# Altium schematic sheet FPGA Banks.SchDoc
size A4
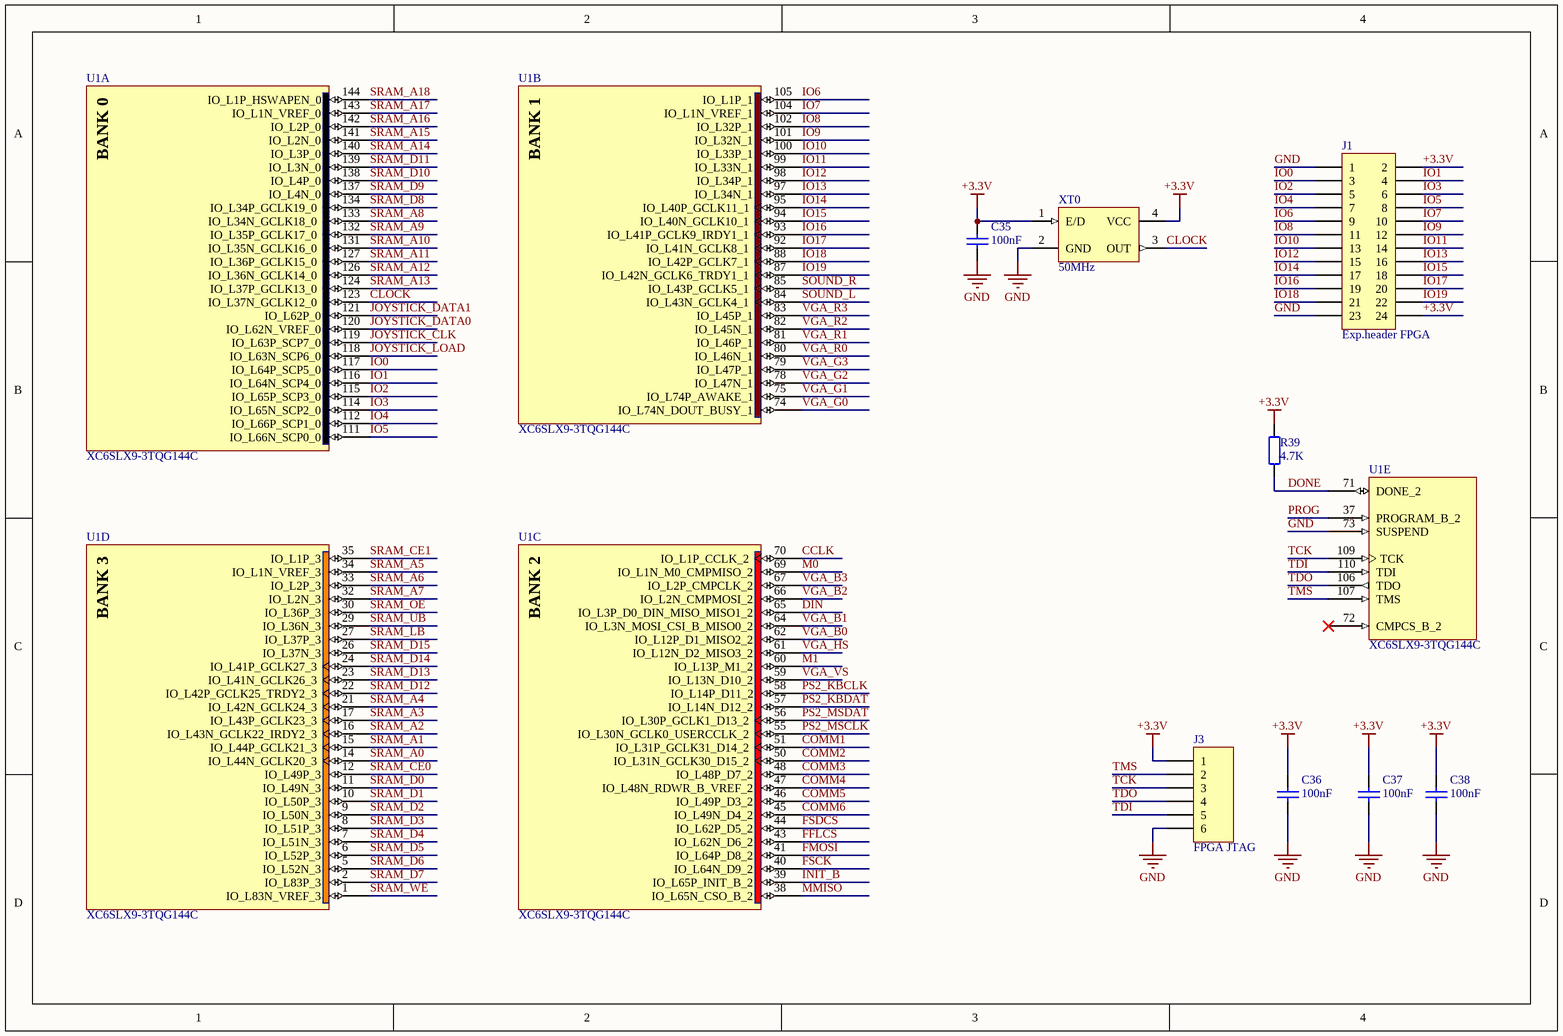
[diagram p0: FPGA Banks.SchDoc]

## Parts
C35  value 100nF  [6-0805_n]  (hidden comment: Cap)
C36  value 100nF  [6-0805_n]  (hidden comment: Cap)
C37  value 100nF  [6-0805_n]  (hidden comment: Cap)
C38  value 100nF  [6-0805_n]  (hidden comment: Cap)
J1  Exp.header FPGA  [HDR2X12]
J3  FPGA JTAG  [HDR1X6]
R39  value 4.7K  [6-0805_N]  (hidden comment: Res2)
U1  XC6SLX9-3TQG144C  [TQG144_N]  (parts A,B,C,D,E of 7)
XT0  value 50MHz  [Oscillator SMD 7x5mm]  (hidden comment: Oscillator)

## Nets
+3.3V: C35.2 C36.2 C37.2 C38.2 J1.2 J1.24 J3.1 R39.1 XT0.1(E/D) XT0.4(VCC)
GND: C35.1 C36.1 C37.1 C38.1 J1.1 J1.23 J3.6 U1.73(SUSPEND) XT0.2(GND)
CCLK: U1.70(IO_L1P_CCLK_2)
CLOCK: U1.123(IO_L37N_GCLK12_0) XT0.3(OUT)
COMM1: U1.51(IO_L31P_GCLK31_D14_2)
COMM2: U1.50(IO_L31N_GCLK30_D15_2)
COMM3: U1.48(IO_L48P_D7_2)
COMM4: U1.47(IO_L48N_RDWR_B_VREF_2)
COMM5: U1.46(IO_L49P_D3_2)
COMM6: U1.45(IO_L49N_D4_2)
DIN: U1.65(IO_L3P_D0_DIN_MISO_MISO1_2)
DONE: R39.2 U1.71(DONE_2)
FFLCS: U1.43(IO_L62N_D6_2)
FMOSI: U1.41(IO_L64P_D8_2)
FSCK: U1.40(IO_L64N_D9_2)
FSDCS: U1.44(IO_L62P_D5_2)
INIT_B: U1.39(IO_L65P_INIT_B_2)
IO0: J1.3 U1.117(IO_L64P_SCP5_0)
IO1: J1.4 U1.116(IO_L64N_SCP4_0)
IO2: J1.5 U1.115(IO_L65P_SCP3_0)
IO3: J1.6 U1.114(IO_L65N_SCP2_0)
IO4: J1.7 U1.112(IO_L66P_SCP1_0)
IO5: J1.8 U1.111(IO_L66N_SCP0_0)
IO6: J1.9 U1.105(IO_L1P_1)
IO7: J1.10 U1.104(IO_L1N_VREF_1)
IO8: J1.11 U1.102(IO_L32P_1)
IO9: J1.12 U1.101(IO_L32N_1)
IO10: J1.13 U1.100(IO_L33P_1)
IO11: J1.14 U1.99(IO_L33N_1)
IO12: J1.15 U1.98(IO_L34P_1)
IO13: J1.16 U1.97(IO_L34N_1)
IO14: J1.17 U1.95(IO_L40P_GCLK11_1)
IO15: J1.18 U1.94(IO_L40N_GCLK10_1)
IO16: J1.19 U1.93(IO_L41P_GCLK9_IRDY1_1)
IO17: J1.20 U1.92(IO_L41N_GCLK8_1)
IO18: J1.21 U1.88(IO_L42P_GCLK7_1)
IO19: J1.22 U1.87(IO_L42N_GCLK6_TRDY1_1)
JOYSTICK_CLK: U1.119(IO_L63P_SCP7_0)
JOYSTICK_DATA0: U1.120(IO_L62N_VREF_0)
JOYSTICK_DATA1: U1.121(IO_L62P_0)
JOYSTICK_LOAD: U1.118(IO_L63N_SCP6_0)
M0: U1.69(IO_L1N_M0_CMPMISO_2)
M1: U1.60(IO_L13P_M1_2)
MMISO: U1.38(IO_L65N_CSO_B_2)
PROG: U1.37(PROGRAM_B_2)
PS2_KBCLK: U1.58(IO_L14P_D11_2)
PS2_KBDAT: U1.57(IO_L14N_D12_2)
PS2_MSCLK: U1.55(IO_L30N_GCLK0_USERCCLK_2)
PS2_MSDAT: U1.56(IO_L30P_GCLK1_D13_2)
SOUND_L: U1.84(IO_L43N_GCLK4_1)
SOUND_R: U1.85(IO_L43P_GCLK5_1)
SRAM_A0: U1.14(IO_L44N_GCLK20_3)
SRAM_A1: U1.15(IO_L44P_GCLK21_3)
SRAM_A2: U1.16(IO_L43N_GCLK22_IRDY2_3)
SRAM_A3: U1.17(IO_L43P_GCLK23_3)
SRAM_A4: U1.21(IO_L42N_GCLK24_3)
SRAM_A5: U1.34(IO_L1N_VREF_3)
SRAM_A6: U1.33(IO_L2P_3)
SRAM_A7: U1.32(IO_L2N_3)
SRAM_A8: U1.133(IO_L34N_GCLK18_0)
SRAM_A9: U1.132(IO_L35P_GCLK17_0)
SRAM_A10: U1.131(IO_L35N_GCLK16_0)
SRAM_A11: U1.127(IO_L36P_GCLK15_0)
SRAM_A12: U1.126(IO_L36N_GCLK14_0)
SRAM_A13: U1.124(IO_L37P_GCLK13_0)
SRAM_A14: U1.140(IO_L3P_0)
SRAM_A15: U1.141(IO_L2N_0)
SRAM_A16: U1.142(IO_L2P_0)
SRAM_A17: U1.143(IO_L1N_VREF_0)
SRAM_A18: U1.144(IO_L1P_HSWAPEN_0)
SRAM_CE0: U1.12(IO_L49P_3)
SRAM_CE1: U1.35(IO_L1P_3)
SRAM_D0: U1.11(IO_L49N_3)
SRAM_D1: U1.10(IO_L50P_3)
SRAM_D2: U1.9(IO_L50N_3)
SRAM_D3: U1.8(IO_L51P_3)
SRAM_D4: U1.7(IO_L51N_3)
SRAM_D5: U1.6(IO_L52P_3)
SRAM_D6: U1.5(IO_L52N_3)
SRAM_D7: U1.2(IO_L83P_3)
SRAM_D8: U1.134(IO_L34P_GCLK19_0)
SRAM_D9: U1.137(IO_L4N_0)
SRAM_D10: U1.138(IO_L4P_0)
SRAM_D11: U1.139(IO_L3N_0)
SRAM_D12: U1.22(IO_L42P_GCLK25_TRDY2_3)
SRAM_D13: U1.23(IO_L41N_GCLK26_3)
SRAM_D14: U1.24(IO_L41P_GCLK27_3)
SRAM_D15: U1.26(IO_L37N_3)
SRAM_LB: U1.27(IO_L37P_3)
SRAM_OE: U1.30(IO_L36P_3)
SRAM_UB: U1.29(IO_L36N_3)
SRAM_WE: U1.1(IO_L83N_VREF_3)
TCK: J3.3 U1.109(TCK)
TDI: J3.5 U1.110(TDI)
TDO: J3.4 U1.106(TDO)
TMS: J3.2 U1.107(TMS)
VGA_B0: U1.62(IO_L12P_D1_MISO2_2)
VGA_B1: U1.64(IO_L3N_MOSI_CSI_B_MISO0_2)
VGA_B2: U1.66(IO_L2N_CMPMOSI_2)
VGA_B3: U1.67(IO_L2P_CMPCLK_2)
VGA_G0: U1.74(IO_L74N_DOUT_BUSY_1)
VGA_G1: U1.75(IO_L74P_AWAKE_1)
VGA_G2: U1.78(IO_L47N_1)
VGA_G3: U1.79(IO_L47P_1)
VGA_HS: U1.61(IO_L12N_D2_MISO3_2)
VGA_R0: U1.80(IO_L46N_1)
VGA_R1: U1.81(IO_L46P_1)
VGA_R2: U1.82(IO_L45N_1)
VGA_R3: U1.83(IO_L45P_1)
VGA_VS: U1.59(IO_L13N_D10_2)

Not connected (* = marked no-connect by the designer): U1 72(CMPCS_B_2)*

## Notes on the sheet
- Title
- Size:
- Date:
- A4
- Number:
- Time:
- Revision:
- Sheet
- of
- File:
- (in symbol XC6SLX9-3TQG144C, part A) BANK 0
- (in symbol XC6SLX9-3TQG144C, part B) BANK 1
- (in symbol XC6SLX9-3TQG144C, part C) BANK 2
- (in symbol XC6SLX9-3TQG144C, part D) BANK 3

## Library data of the parts
C35-C38 = Cap: Capacitor; Published: 8-Jun-2000; LatestRevisionDate: 17-Jul-2002; LatestRevisionNote: Re-released for DXP Platform.; PackageReference: RAD-0.3; Publisher: Altium Limited; PackageDescription: Radial Cap, Thru-Hole; 2 Leads; 0.3 in Pin Spacing
J1 = Header 12X2: Header, 12-Pin, Dual row; LatestRevisionDate: 17-Jul-2002; LatestRevisionNote: Re-released for DXP Platform.; Publisher: Altium Limited
J3 = Header 6: Header, 6-Pin; LatestRevisionDate: 17-Jul-2002; LatestRevisionNote: Re-released for DXP Platform.; Publisher: Altium Limited
R39 = Res2: Resistor; Published: 8-Jun-2000; LatestRevisionDate: 17-Jul-2002; LatestRevisionNote: Re-released for DXP Platform.; PackageReference: AXIAL-0.4; Publisher: Altium Limited; PackageDescription: Axial Device, Thru-Hole; 2 Leads; 0.4 in Pin Spacing
U1 = XC6SLX9-3TQG144C: Spartan-6 LX 1.2V FPGA, 102 User I/Os, 144-Pin TQFP (0.5mm Pitch), Speed Grade 3, Commercial Grade, Pb-Free; Published: 17-Nov-2009; DatasheetVersion: ver1.6, Nov-2010; PackageVersion: ver1.2, Jun-2004; PackageReference: TQG144; Publisher: Altium Limited; PackageDescription: 144-Pin Thin Quad Flat Pack (TQG144) - Pb-Free; Supplier 1: Digi-Key; Supplier Part Number 1: XC6SLX9-3TQG144C-ND; Code_JEDEC: MS-026-BFB; ComponentLink1Description: Manufacturer Link; ComponentLink1URL: http://www.xilinx.com; ComponentLink2Description: Spartan-6 Datasheet; ComponentLink2URL: http://www.xilinx.com/support/documentation/data_sheets/ds160.pdf; ComponentLink3Description: Spartan-6 Documents; ComponentLink3URL: http://www.xilinx.com/support/documentation/spartan-6.htm; ComponentLink4Description: Xilinx.com Home; ComponentLink4URL: http://www.xilinx.com